# EasyEDA Pro project ProProject_Access Control Core_2024-05-28.epro, schematic V2.0.1 Core Schematic

## Sheets
1 Microcontroller: Create Date: 2024-05-01; Page Name: Microcontroller; Project Name: Access Control V2; Schematic Name: V2.0.1 Core Schematic; Update Date: 2024-05-13; Company: EasyEDA.com; Drawn: EasyEDA; Page Size: A4; Part Number: JLCPCB-002; Reviewed: EasyEDA; Version: V0.1
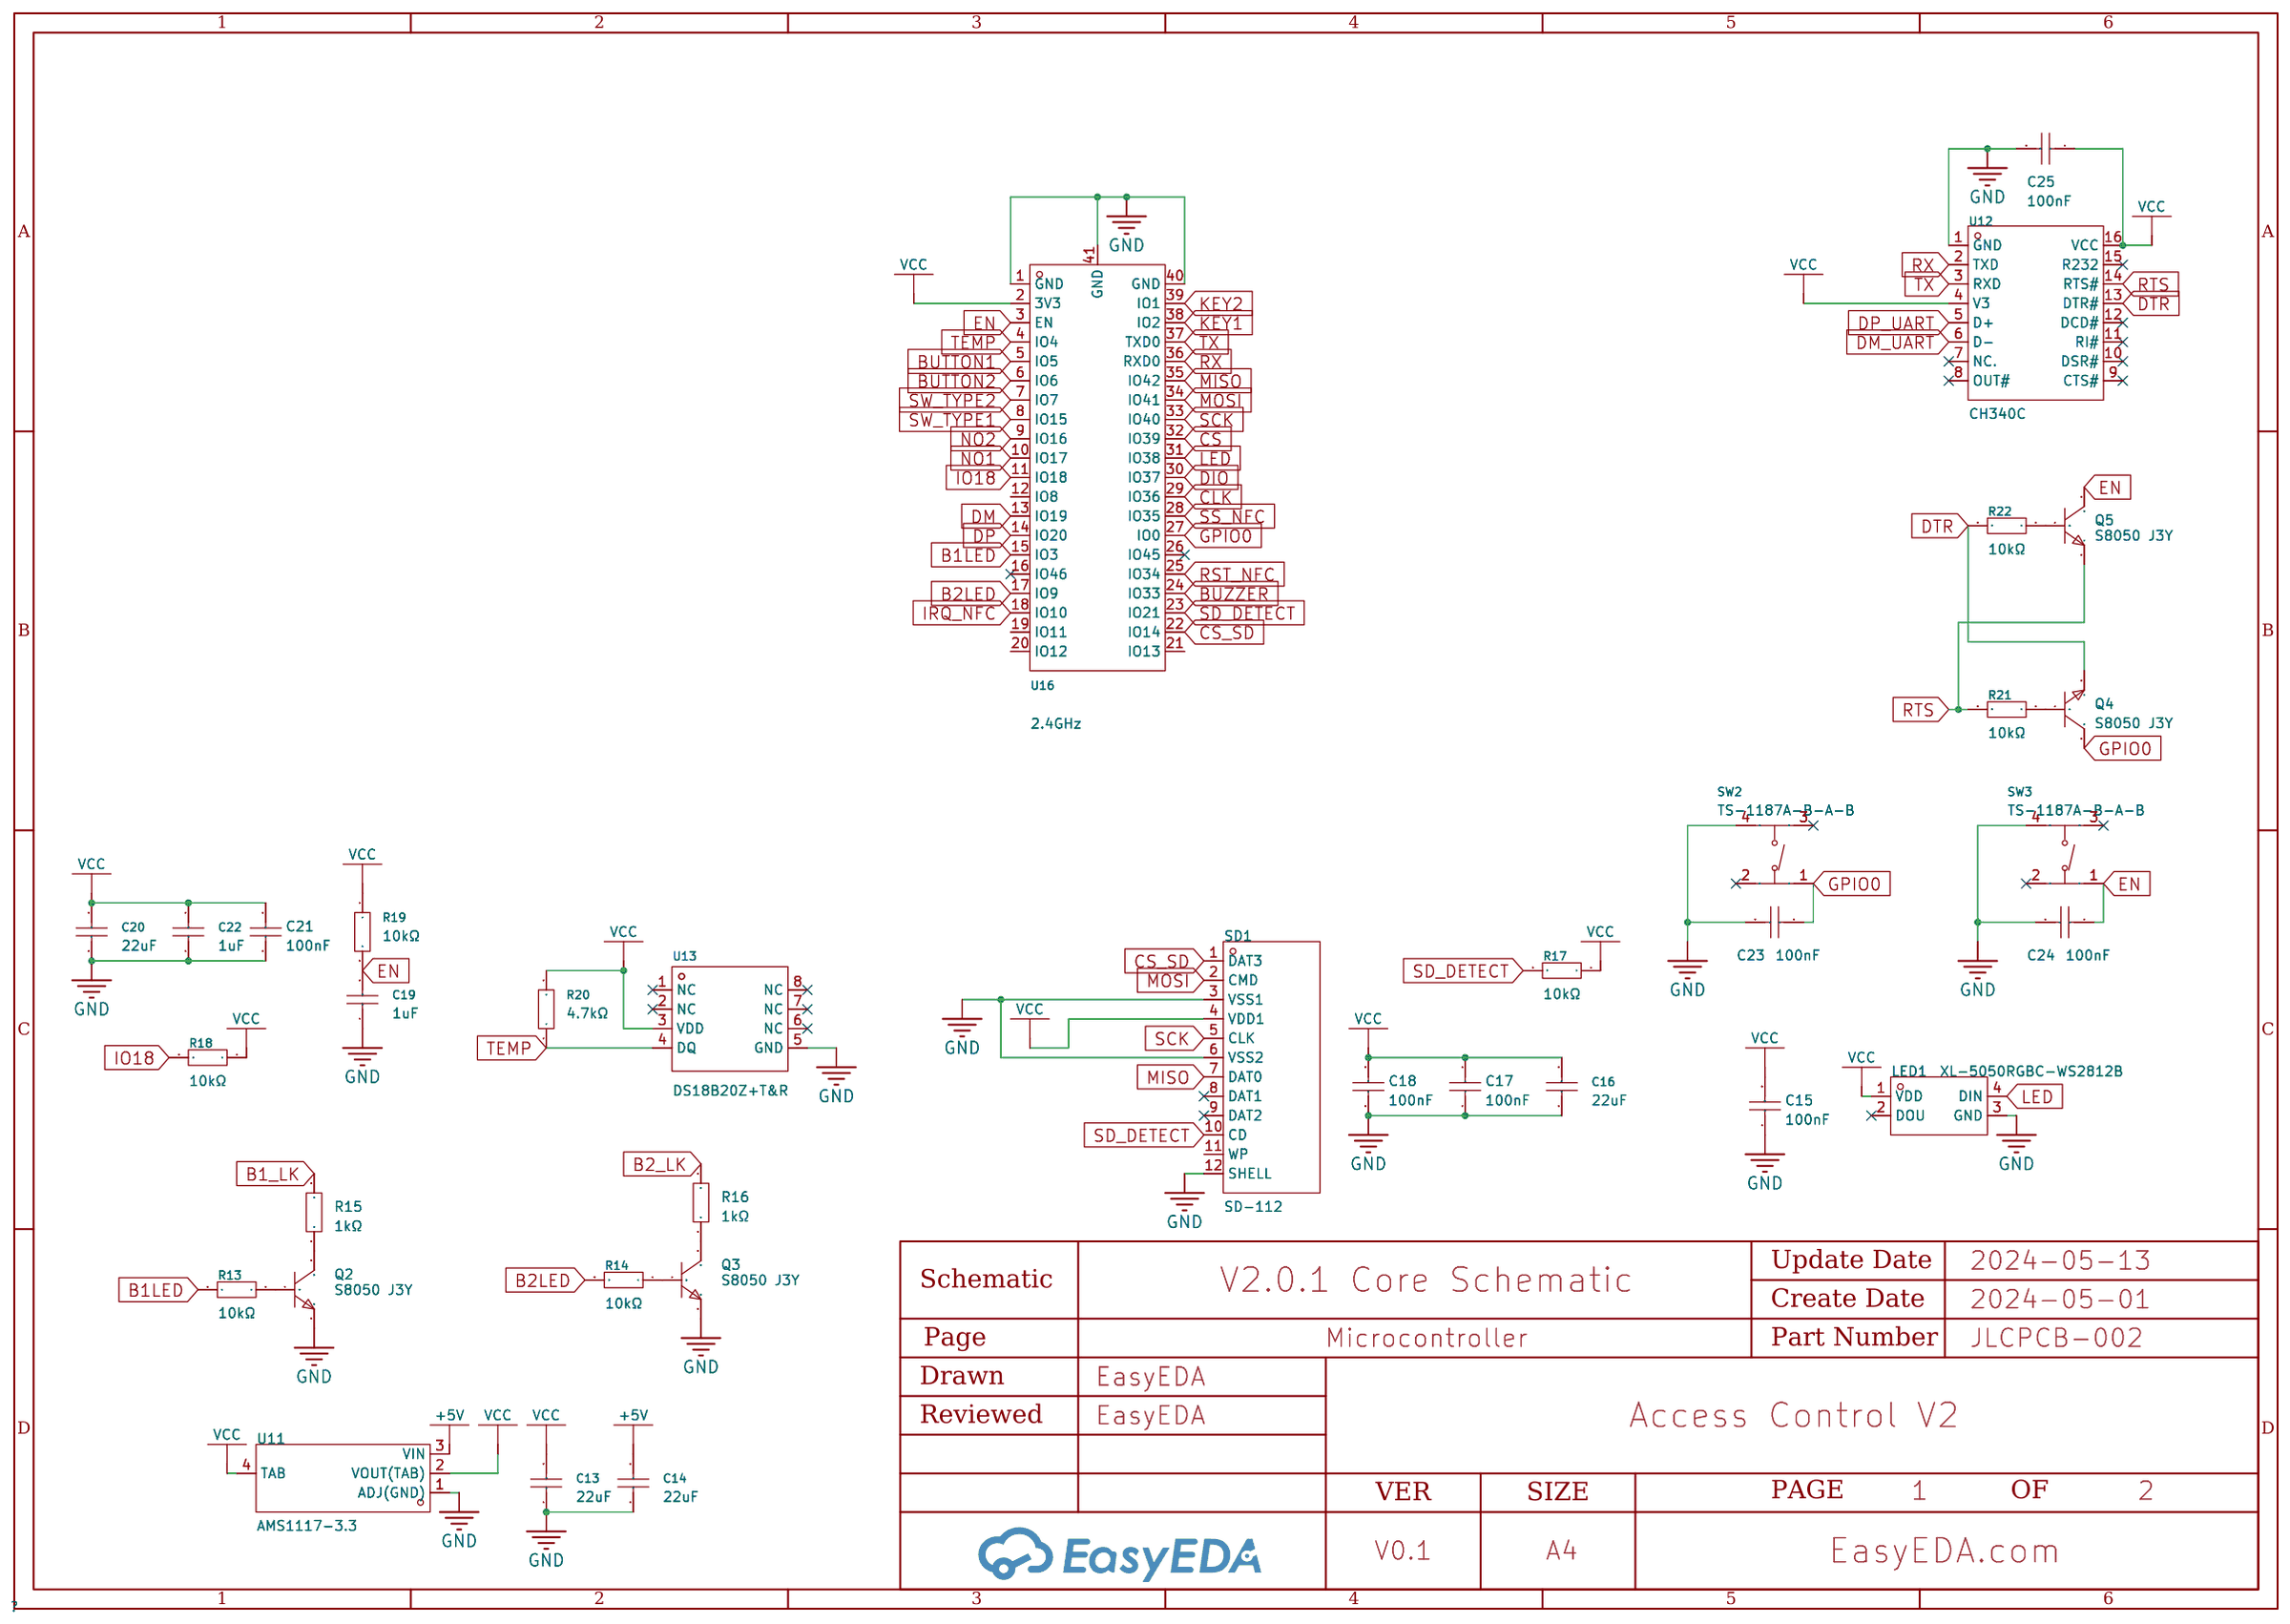
[diagram p0: Microcontroller]
2 Interfaces: Page Name: Interfaces
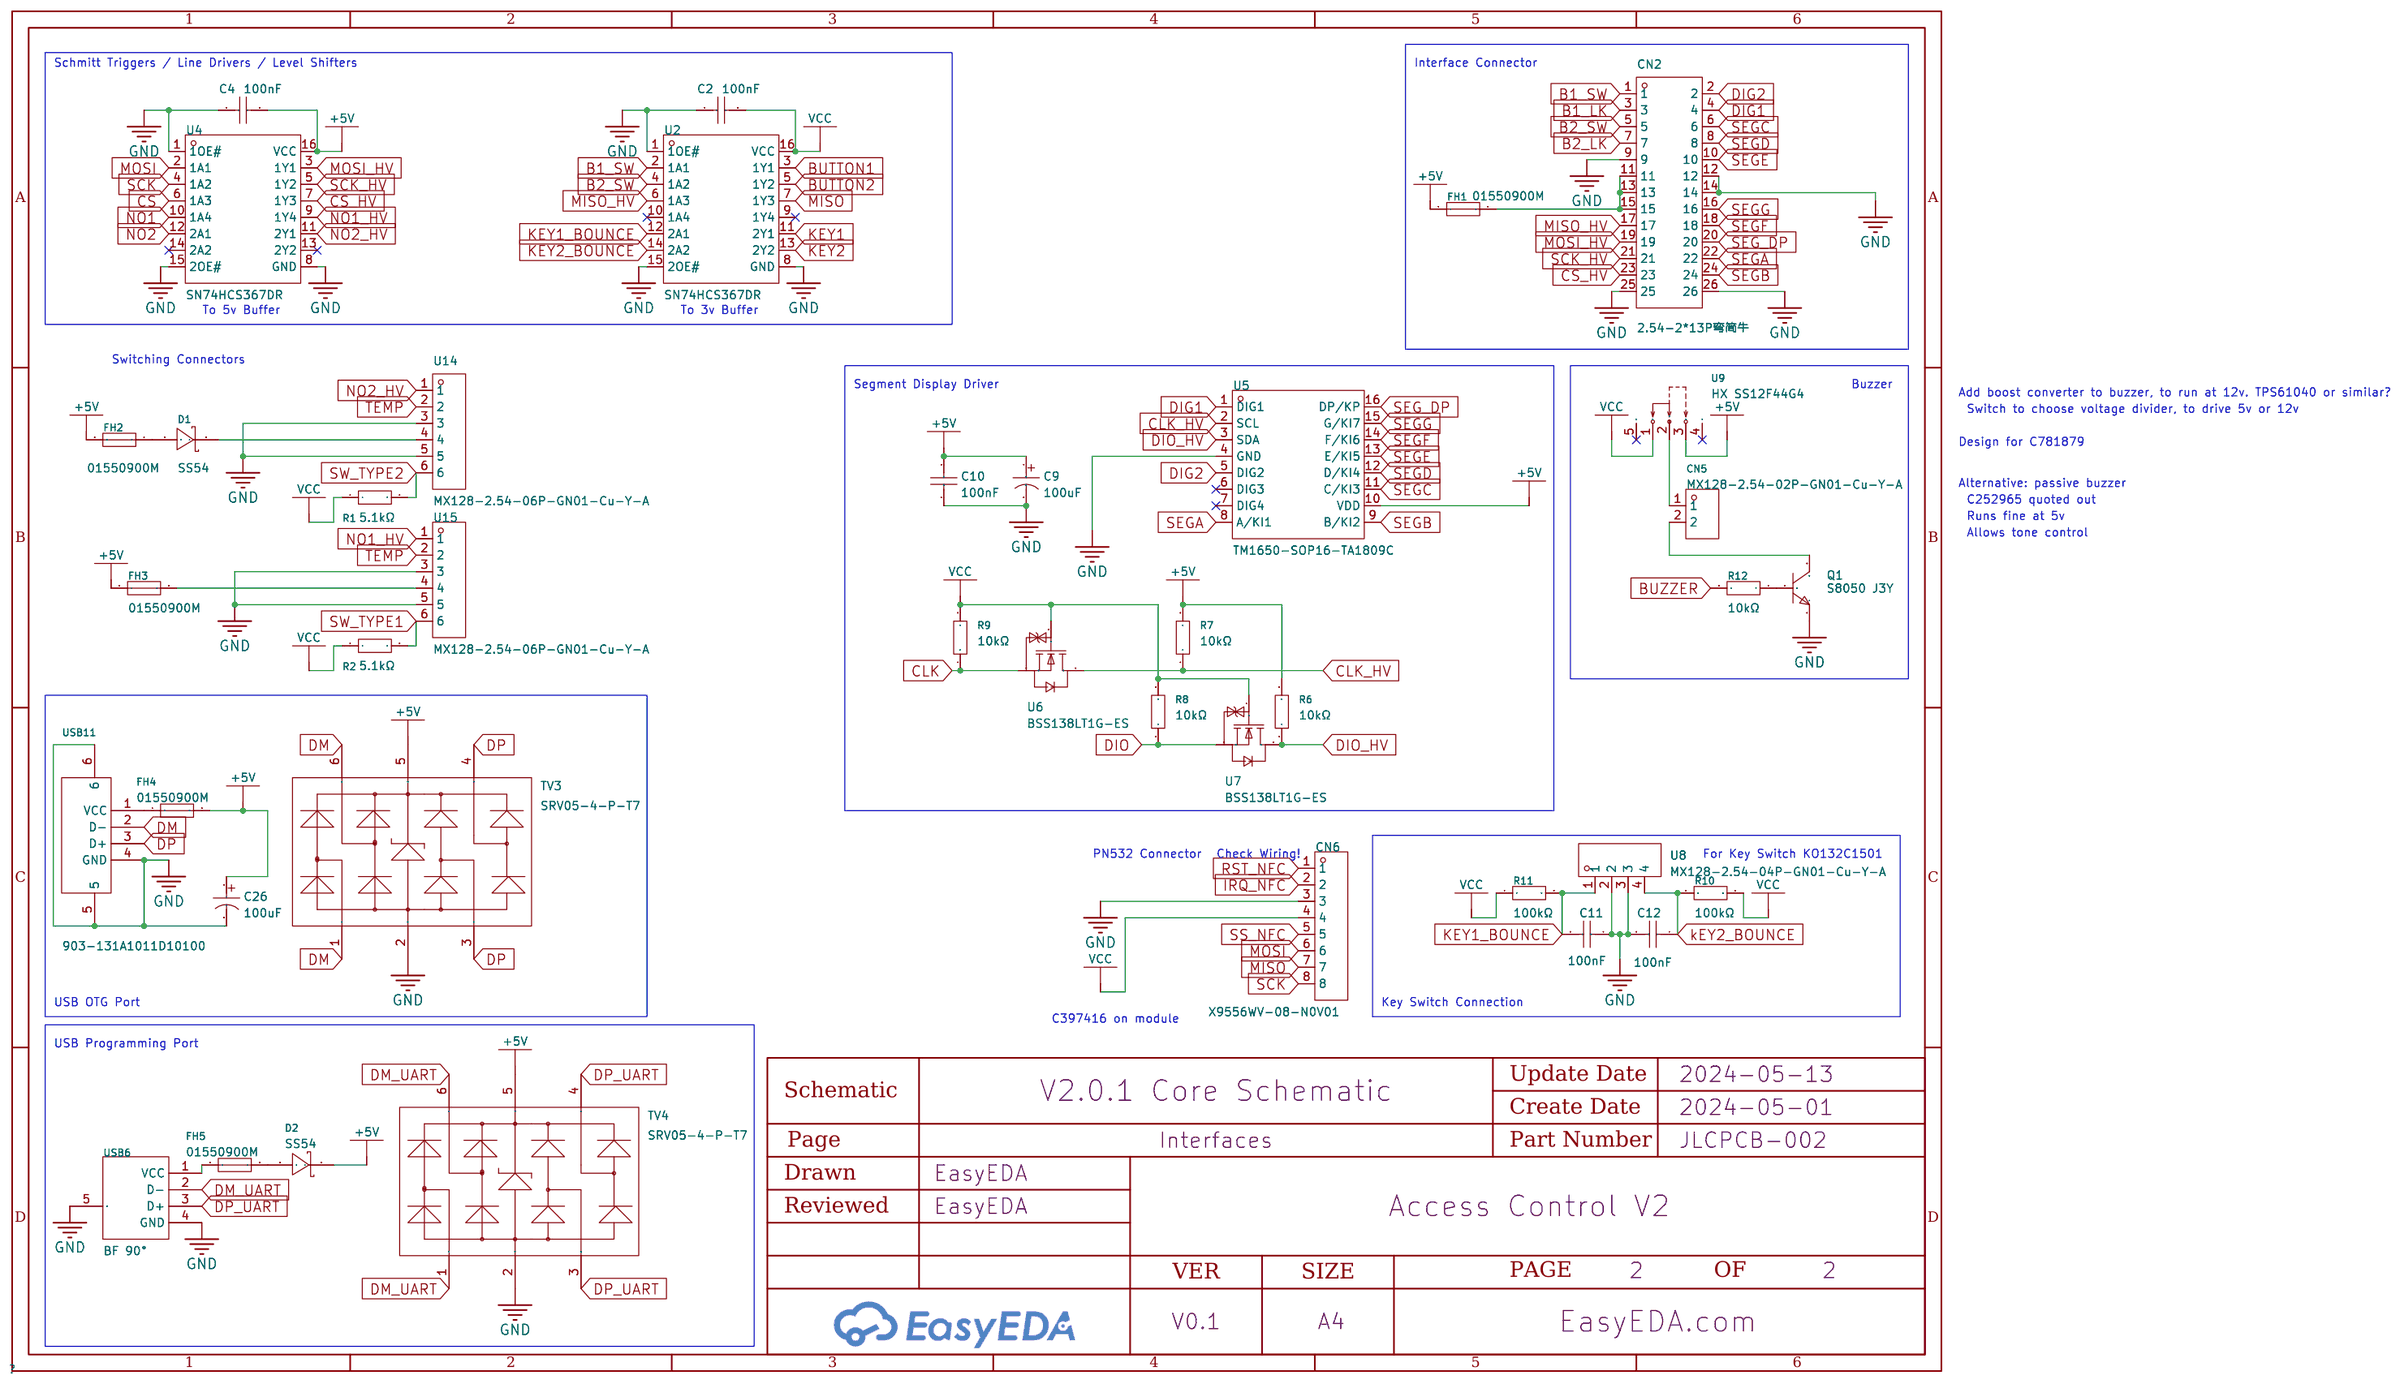
[diagram p1: Interfaces]

## Parts
sheet Interfaces
C2  100nF  [C0805]
C4  100nF  [C0805]
C9  100uF  [CAP-TH_BD5.0-P2.00-D0.8-FD]
C10  100nF  [C0805]
C11  100nF  [C0805]
C12  100nF  [C0805]
C26  100uF  [CAP-TH_BD5.0-P2.00-D0.8-FD]
CN2  2.54-2*13P弯简牛  [IDC-TH_26P-P2.54_BOOMELE-2X13P-2.54MM-H]
CN5  MX128-2.54-02P-GN01-Cu-Y-A  [CONN-TH_2P-P2.54_MX128-2.54-GN01-02P-CU-Y-A]
CN6  X9556WV-08-N0V01  [CONN-TH_8P-P2.54_X9556WV-08-N0V01]
D1  SS54  [SMA_L4.4-W2.8-LS5.4-R-RD]
D2  SS54  [SMA_L4.4-W2.8-LS5.4-R-RD]
FH1  01550900M  [FUSE-SMD_L9.8-W5.0]
FH2  01550900M  [FUSE-SMD_L9.8-W5.0]
FH3  01550900M  [FUSE-SMD_L9.8-W5.0]
FH4  01550900M  [FUSE-SMD_L9.8-W5.0]
FH5  01550900M  [FUSE-SMD_L9.8-W5.0]
Q1  S8050 J3Y  [SOT-23-3_L3.0-W1.7-P0.95-LS2.9-BR]
R1  5.1kΩ  [R0805]
R2  5.1kΩ  [R0805]
R6  10kΩ  [R0805]
R7  10kΩ  [R0805]
R8  10kΩ  [R0805]
R9  10kΩ  [R0805]
R10  100kΩ  [R0805]
R11  100kΩ  [R0805]
R12  10kΩ  [R0805]
TV3  SRV05-4-P-T7  [SOT-23-6_L2.9-W1.6-P0.95-LS2.8-BR]
TV4  SRV05-4-P-T7  [SOT-23-6_L2.9-W1.6-P0.95-LS2.8-BR]
U2  SN74HCS367DR  [SOIC-16_L9.9-W3.9-P1.27-LS6.0-BL-1]
U4  SN74HCS367DR  [SOIC-16_L9.9-W3.9-P1.27-LS6.0-BL-1]
U5  TM1650-SOP16-TA1809C  [SOP-16_L10.0-W3.9-P1.27-LS6.0-BL]
U6  BSS138LT1G-ES  [SOT-23_L2.9-W1.3-P1.90-LS2.4-BR]
U7  BSS138LT1G-ES  [SOT-23_L2.9-W1.3-P1.90-LS2.4-BR]
U8  MX128-2.54-04P-GN01-Cu-Y-A  [CONN-TH_4P-P2.54_MX128-2.54-GN01-04P-CU-Y-A]
U9  HX SS12F44G4  [SW-TH_SHOU-HAN_SS12F44G4]
U14  MX128-2.54-06P-GN01-Cu-Y-A  [CONN-TH_6P-P2.54_MX128-2.54-6P]
U15  MX128-2.54-06P-GN01-Cu-Y-A  [CONN-TH_6P-P2.54_MX128-2.54-6P]
USB6  BF 90°  [USB-B_TH_BF90]
USB11  903-131A1011D10100  [USB-A-TH_C46407]
sheet Microcontroller
C13  22uF  [C1206]
C14  22uF  [C1206]
C15  100nF  [C0805]
C16  22uF  [C1206]
C17  100nF  [C0805]
C18  100nF  [C0805]
C19  1uF  [C0805]
C20  22uF  [C1206]
C21  100nF  [C0805]
C22  1uF  [C0805]
C23  100nF  [C0805]
C24  100nF  [C0805]
C25  100nF  [C0805]
LED1  XL-5050RGBC-WS2812B  [LED-SMD_4P-L5.0-W5.0-BL_XL-5050RGBC]
Q2  S8050 J3Y  [SOT-23-3_L3.0-W1.7-P0.95-LS2.9-BR]
Q3  S8050 J3Y  [SOT-23-3_L3.0-W1.7-P0.95-LS2.9-BR]
Q4  S8050 J3Y  [SOT-23-3_L3.0-W1.7-P0.95-LS2.9-BR]
Q5  S8050 J3Y  [SOT-23-3_L3.0-W1.7-P0.95-LS2.9-BR]
R13  10kΩ  [R0805]
R14  10kΩ  [R0805]
R15  1kΩ  [R0805]
R16  1kΩ  [R0805]
R17  10kΩ  [R0805]
R18  10kΩ  [R0805]
R19  10kΩ  [R0805]
R20  4.7kΩ  [R0805]
R21  10kΩ  [R0805]
R22  10kΩ  [R0805]
SD1  SD-112  [SD-SMD_SD-112]
SW2  TS-1187A-B-A-B  [SW-SMD_4P-L5.1-W5.1-P3.70-LS6.5-TL-2]
SW3  TS-1187A-B-A-B  [SW-SMD_4P-L5.1-W5.1-P3.70-LS6.5-TL-2]
U11  AMS1117-3.3  [SOT-223-4_L6.5-W3.5-P2.30-LS7.0-BR]
U12  CH340C  [SOP-16_L10.0-W3.9-P1.27-LS6.0-BL]
U13  DS18B20Z+T&R  [SOIC-8_L4.9-W3.9-P1.27-LS6.0-BL]
U16  2.4GHz  [WIRELM-SMD_ESP32-S3-WROOM-1]

## Library data of the parts
C2 C4 C10-C12 C15 C17 C18 C21 C23-C25 = CC0805KRX7R9BB104: Capacitance: Tolerance:±10% Tolerance:±10% Voltage Rated: Temperature Coefficient:; LCSC Part Name: 100nF ±10% 50V; Supplier Part: C49678; Manufacturer: YAGEO(国巨); Supplier Footprint: 0805; JLCPCB Part Class: Basic Part; Datasheet: https://atta.szlcsc.com/upload/public/pdf/source/20180224/C181747_15194369449651363981.pdf; Supplier: LCSC; Tolerance: ±10%
C9 C26 = KS107M016D07RR0VH2FP0: Capacitance:100uF Tolerance:±20% Tolerance:±20% Rated Voltage: Ripple Current:- Equivalent Series Resistance(ESR):- Lead Spacing: φD: L: Lifetime @ Temp:1000hrs@105℃ Operating Temperature:-40℃~+105℃ Operating Temperature:-40℃~+105℃; LCSC Part Name: 100uF ±20% 16V; Supplier Part: C43803; Manufacturer: CX(承兴); Supplier Footprint: 插件,D5xL7mm; JLCPCB Part Class: Extended Part; Datasheet: https://atta.szlcsc.com/upload/public/pdf/source/20230817/0DB19D47181DB7F2222DAA6444591EF5.pdf; Supplier: LCSC; Tolerance: ±20%; Lifetime @ Temp: 1000hrs@105℃; Operating Temperature: -40℃~+105℃
CN2 = 2.54-2*13P弯简牛: Connector Type:简牛座 Pitch:2.54mm Structure:2x13P Holder Type:Right-Angle Row Spacing:2.54mm Number of Rows:2 Pin Number in each Row:13 Contact Material:- Contact Plating:-; LCSC Part Name: 2.54mm 2x13P 排数:2 每排P数:13; Supplier Part: C21167; Manufacturer: BOOMELE(博穆精密); Supplier Footprint: 弯插,P=2.54mm; JLCPCB Part Class: Extended Part; Datasheet: https://atta.szlcsc.com/upload/public/pdf/source/20190318/C79866_F562B2ABC13A71FF1CBDB4755391DD5E.pdf; Supplier: LCSC; Connector Type: 简牛座; Pitch: 2.54mm; Structure: 2x13P; Holder Type: Right-Angle; Row Spacing: 2.54mm; Number of Rows: 2; Pin Number in each Row: 13
CN5 = MX128-2.54-02P-GN01-Cu-Y-A: Structure:1x2P Pitch:2.54mm Color:Green Mounting Style:Straight Current Rating (Max):6A Voltage Rating (Max):150V Number of Pins:2P Number of Rows:1 Wire Gauge - AWG:18~24 Wire Gauge - AWG:18~24 Wire Gauge - mm2:1 Wire Gauge - mm2:1 Number of PINs Per Row; LCSC Part Name: 2.54mm 1x2P 排数:1 每排P数:2 直插; Supplier Part: C5188442; Manufacturer: MAX(迈旭); Supplier Footprint: 插件,P=2.54mm; JLCPCB Part Class: Extended Part; Datasheet: https://atta.szlcsc.com/upload/public/pdf/source/20230914/7C75AD31AD41EB9EF855A76DB002C0D2.pdf; Supplier: LCSC; Structure: 1x2P; Pitch: 2.54mm; Color: Green; Mounting Style: Straight; Current Rating (Max): 6A; Voltage Rating (Max): 150V; Number of Pins: 2P; Number of Rows: 1; Wire Gauge - AWG: 18~24; Wire Gauge - mm2: 1; Number of PINs Per Row: 2; Contact Material: Copper Alloy; Contact Plating: Tin; Operating Temperature Range: -40℃~+105℃
CN6 = X9556WV-08-N0V01: Pins Structure:1x8P Pitch:2.54mm Mounting Style:Straight Reference Series:- Number of Pins:8P Number of Rows:1 Number of PINs Per Row:8 Row Spacing:- Current Rating (Max):3A Contact Material:Brass Contact Plating:Tin Operating Temperature Range:- Operatin; LCSC Part Name: 1x8P 间距:2.54mm 直插; Supplier Part: C397407; Manufacturer: XKB Connection(中国星坤); Supplier Footprint: 插件,P=2.54mm; JLCPCB Part Class: Extended Part; Datasheet: https://atta.szlcsc.com/upload/public/pdf/source/20211009/29F6A6601B8B0251536EC4657E012C1F.pdf; Supplier: LCSC; Pins Structure: 1x8P; Pitch: 2.54mm; Mounting Style: Straight; Number of Pins: 8P; Number of Rows: 1; Number of PINs Per Row: 8; Current Rating (Max): 3A; Contact Material: Brass; Contact Plating: Tin
D1 D2 = SS54_C22452: Forward Voltage (Vf@If):550mV@5A Reverse Voltage (Vr):40V Average Rectified Current (Io):5A Reverse Leakage Current (Ir):1mA@40V; LCSC Part Name: 电压:40V 电流:5A; Supplier Part: C22452; Manufacturer: MDD; Supplier Footprint: SMA(DO-214AC); JLCPCB Part Class: Basic Part; Datasheet: https://atta.szlcsc.com/upload/public/pdf/source/20230314/529CD85F9B31F69841D3A079BC07E377.pdf; Supplier: LCSC; Forward Voltage (Vf@If): 550mV@5A; Reverse Voltage (Vr): 40V; Average Rectified Current (Io): 5A; Reverse Leakage Current (Ir): 1mA@40V
FH1-FH5 = 01550900M: Fuseholder Type:- Fuse Type:- Fuse Size:-; Supplier Part: C108518; Manufacturer: Littelfuse(美国力特); Supplier Footprint: SMD,5.0x9.7mm; JLCPCB Part Class: Extended Part; Datasheet: https://atta.szlcsc.com/upload/public/pdf/source/20181031/C315847_D8C8759CD5ED576C0EA975A2D5312378.pdf; Supplier: LCSC
Q1-Q5 = S8050 J3Y_C2146: Transistor Type: Collector Current (Ic): Collector-Emitter Breakdown Voltage (Vceo): Power Dissipation (Pd): DC Current Gain (hFE@Ic,Vce):200@50mA,1V DC Current Gain (hFE@Ic,Vce):200@50mA,1V Transition Frequency (fT):150MHz Collector Cut-Off Current (Icbo; LCSC Part Name: S8050 J3Y(RANGE:200-350) H档(200-350); Supplier Part: C2146; Manufacturer: CJ(江苏长电/长晶); Supplier Footprint: SOT-23; JLCPCB Part Class: Basic Part; Datasheet: https://atta.szlcsc.com/upload/public/pdf/source/20140809/1457707209234.pdf; Supplier: LCSC; DC Current Gain (hFE@Ic,Vce): 200@50mA,1V; Transition Frequency (fT): 150MHz; Collector Cut-Off Current (Icbo): 100nA; Collector-Emitter Saturation Voltage (VCE(sat)@Ic,Ib): 600mV@500mA,50mA
R1 R2 = 0805W8F5101T5E: Type:Thick Film Resistors Resistance:5.1kΩ Tolerance:±1% Tolerance:±1% Power(Watts): Overload Voltage (Max): Temperature Coefficient:±100ppm/℃ Temperature Coefficient:±100ppm/℃ Operating Temperature Range:-55℃~+155℃ Operating Temperature Range:-55℃~+155℃; LCSC Part Name: 5.1kΩ ±1% 125mW 厚膜电阻; Supplier Part: C27834; Manufacturer: UNI-ROYAL(厚声); Supplier Footprint: 0805; JLCPCB Part Class: Basic Part; Datasheet: https://atta.szlcsc.com/upload/public/pdf/source/20200306/C422600_1E6D84923E4A46A82E41ADD87F860B5C.pdf; Supplier: LCSC; Type: Thick Film Resistors; Tolerance: ±1%; Temperature Coefficient: ±100ppm/℃; Operating Temperature Range: -55℃~+155℃
R6-R9 R12-R14 R17-R19 R21 R22 = 0805W8F1002T5E: Type:Thick Film Resistors Resistance:10kΩ Tolerance:±1% Tolerance:±1% Power(Watts): Overload Voltage (Max): Temperature Coefficient:±100ppm/℃ Temperature Coefficient:±100ppm/℃ Operating Temperature Range:-55℃~+155℃ Operating Temperature Range:-55℃~+155℃; LCSC Part Name: 10kΩ ±1% 125mW 厚膜电阻; Supplier Part: C17414; Manufacturer: UNI-ROYAL(厚声); Supplier Footprint: 0805; JLCPCB Part Class: Basic Part; Datasheet: https://atta.szlcsc.com/upload/public/pdf/source/20200306/C422600_1E6D84923E4A46A82E41ADD87F860B5C.pdf; Supplier: LCSC; Type: Thick Film Resistors; Tolerance: ±1%; Temperature Coefficient: ±100ppm/℃; Operating Temperature Range: -55℃~+155℃
R10 R11 = 0805W8F1003T5E: Type:Thick Film Resistors Resistance:100kΩ Tolerance:±1% Tolerance:±1% Power(Watts): Overload Voltage (Max): Temperature Coefficient:±100ppm/℃ Temperature Coefficient:±100ppm/℃ Operating Temperature Range:-55℃~+155℃ Operating Temperature Range:-55℃~+155℃; LCSC Part Name: 100kΩ ±1% 125mW 厚膜电阻; Supplier Part: C149504; Manufacturer: UNI-ROYAL(厚声); Supplier Footprint: 0805; JLCPCB Part Class: Basic Part; Datasheet: https://atta.szlcsc.com/upload/public/pdf/source/20200306/C422600_1E6D84923E4A46A82E41ADD87F860B5C.pdf; Supplier: LCSC; Type: Thick Film Resistors; Tolerance: ±1%; Temperature Coefficient: ±100ppm/℃; Operating Temperature Range: -55℃~+155℃
TV3 TV4 = SRV05-4-P-T7_C85364: Reverse Stand-Off Voltage (Vrwm):5V Breakdown Voltage:6V Peak Pulse Current (Ipp)@10/1000s:1A@8/20us Maximum Clamping Voltage:12V; LCSC Part Name: Vrwm:5V; Supplier Part: C85364; Manufacturer: PROTEK; Supplier Footprint: SOT-23-6; Datasheet: https://atta.szlcsc.com/upload/public/pdf/source/20161024/1477288764689.pdf; Supplier: LCSC; Reverse Stand-Off Voltage (Vrwm): 5V; Breakdown Voltage: 6V; Peak Pulse Current (Ipp)@10/1000μs: 1A@8/20us; Maximum Clamping Voltage: 12V
U2 U4 = SN74HCS367DR: Input type:Schmitt Trigger output type:Tri-State Supply Voltage:2V~6V Supply Voltage:2V~6V Number of Elements:2 Number of Bits per Element:6 Sink Current:7.8mA Source Current:7.8mA Logic Family:74HCS Operating Temperature:-40℃~+125℃ Operating Temperature:; Supplier Part: C3756951; Manufacturer: TI(德州仪器); Supplier Footprint: SOIC-16; Datasheet: https://www.ti.com/cn/lit/gpn/sn74hcs367; Supplier: LCSC; Input type: Schmitt Trigger; output type: Tri-State; Supply Voltage: 2V~6V; Number of Elements: 2; Number of Bits per Element: 6; Sink Current: 7.8mA; Source Current: 7.8mA; Logic Family: 74HCS; Operating Temperature: -40℃~+125℃
U5 = TM1650-SOP16-TA1809C: Supplier Part: C22374376; Manufacturer: TM(天微); Supplier Footprint: SOP-16; JLCPCB Part Class: Extended Part; Datasheet: https://atta.szlcsc.com/upload/public/pdf/source/20240401/69E29AB59A432C6008276407709336EB.pdf; Supplier: LCSC
U6 U7 = BSS138LT1G-ES: Type:1个NChannel Drain Source Voltage (Vdss): Continuous Drain Current (Id): Power Dissipation (Pd): Drain Source On Resistance (RDS(on)@Vgs,Id):1.5Ω@10V,500mA Gate Threshold Voltage (Vgs(th)@Id):1V@250uA Total Gate Charge (Qg@Vgs):650pC Input Capacitance; LCSC Part Name: 1个N沟道 耐压:50V 电流:300mA; Supplier Part: C5224261; Manufacturer: ElecSuper(静芯微); Supplier Footprint: SOT-23; JLCPCB Part Class: Extended Part; Datasheet: https://atta.szlcsc.com/upload/public/pdf/source/20230109/BF1B01F1B7DA8CE5713DE49989F30FFC.pdf; Supplier: LCSC; Type: 1个NChannel; Drain Source On Resistance (RDS(on)@Vgs,Id): 1.5Ω@10V,500mA; Gate Threshold Voltage (Vgs(th)@Id): 1V@250uA; Total Gate Charge (Qg@Vgs): 650pC; Input Capacitance (Ciss@Vds): 25pF; Reverse Transfer Capacitance (Crss@Vds): 2.2pF
U8 = MX128-2.54-04P-GN01-Cu-Y-A: Structure:1x4P Pitch:2.54mm Color:Green Mounting Style:Straight Current Rating (Max):6A Voltage Rating (Max):150V Number of Pins:4P Number of Rows:1 Wire Gauge - AWG:18~24 Wire Gauge - AWG:18~24 Wire Gauge - mm2:1 Wire Gauge - mm2:1 Number of PINs Per Row; LCSC Part Name: 2.54mm 1x4P 排数:1 每排P数:4 直插; Supplier Part: C5188444; Manufacturer: MAX(迈旭); Supplier Footprint: 插件,P=2.54mm; JLCPCB Part Class: Extended Part; Datasheet: https://atta.szlcsc.com/upload/public/pdf/source/20230914/7C75AD31AD41EB9EF855A76DB002C0D2.pdf; Supplier: LCSC; Structure: 1x4P; Pitch: 2.54mm; Color: Green; Mounting Style: Straight; Current Rating (Max): 6A; Voltage Rating (Max): 150V; Number of Pins: 4P; Number of Rows: 1; Wire Gauge - AWG: 18~24; Wire Gauge - mm2: 1; Number of PINs Per Row: 4; Contact Material: Copper Alloy; Contact Plating: Tin; Operating Temperature Range: -40℃~+105℃
U9 = HX SS12F44G4: LCSC Part Name: 拨动开关 立式两档拨动,单排3PIN脚+2固定脚插件,12.2x5.5x6,黑柄4mm; Supplier Part: C5149844; Manufacturer: hanxia(韩下); Supplier Footprint: 插件; Datasheet: https://atta.szlcsc.com/upload/public/pdf/source/20220907/7744BC3E7D0676B683701560C23A620B.pdf; Supplier: LCSC
U14 U15 = MX128-2.54-06P-GN01-Cu-Y-A: Structure:1x6P Pitch:2.54mm Color:Green Mounting Style:Straight Current Rating (Max):6A Voltage Rating (Max):150V Number of Pins:6P Number of Rows:1 Wire Gauge - AWG:18~24 Wire Gauge - AWG:18~24 Wire Gauge - mm2:1 Wire Gauge - mm2:1 Number of PINs Per Row; LCSC Part Name: 2.54mm 1x6P 排数:1 每排P数:6 直插; Supplier Part: C5188446; Manufacturer: MAX(迈旭); Supplier Footprint: 插件,P=2.54mm; JLCPCB Part Class: Extended Part; Datasheet: https://atta.szlcsc.com/upload/public/pdf/source/20230914/7C75AD31AD41EB9EF855A76DB002C0D2.pdf; Supplier: LCSC; Structure: 1x6P; Pitch: 2.54mm; Color: Green; Mounting Style: Straight; Current Rating (Max): 6A; Voltage Rating (Max): 150V; Number of Pins: 6P; Number of Rows: 1; Wire Gauge - AWG: 18~24; Wire Gauge - mm2: 1; Number of PINs Per Row: 6; Contact Material: Copper Alloy; Contact Plating: Tin; Operating Temperature Range: -40℃~+105℃
USB6 = BF 90°: Connector Type:Type-B Standard:USB 2.0 Gender:Female Number of Ports:1 Number of Contacts:4P Mounting Style:Right-Angle Current Rating - Power (Max):1.5A Operating Temperature Range:-25℃~+85℃ Operating Temperature Range:-25℃~+85℃; LCSC Part Name: Type-B 母 弯插; Supplier Part: C456014; Manufacturer: SHOU HAN(首韩); Supplier Footprint: 插件; JLCPCB Part Class: Extended Part; Datasheet: https://atta.szlcsc.com/upload/public/pdf/source/20191113/C456014_C740506ED5D4B26CF619D62A688F072E.pdf; Supplier: LCSC; Connector Type: Type-B; Standard: USB 2.0; Gender: Female; Number of Ports: 1; Number of Contacts: 4P; Mounting Style: Right-Angle; Current Rating - Power (Max): 1.5A; Operating Temperature Range: -25℃~+85℃
USB11 = 903-131A1011D10100: Connector Type:Type-A Standard:USB 2.0 Gender:Female Number of Ports:1 Number of Contacts:4P Current Rating - Power (Max):1.5A; LCSC Part Name: Type-A 母; Supplier Part: C46407; Manufacturer: 精拓金; Supplier Footprint: 插件; JLCPCB Part Class: Extended Part; Datasheet: https://atta.szlcsc.com/upload/public/pdf/source/20210301/C46407_0FDCFD777E72B2503A3E09AE32E4643C.pdf; Supplier: LCSC; Connector Type: Type-A; Standard: USB 2.0; Gender: Female; Number of Ports: 1; Number of Contacts: 4P; Current Rating - Power (Max): 1.5A
C13 C14 C16 C20 = CL31A226KAHNNNE: Capacitance: Tolerance:±10% Tolerance:±10% Voltage Rated: Temperature Coefficient:; LCSC Part Name: 22uF ±10% 25V; Supplier Part: C12891; Manufacturer: SAMSUNG(三星); Supplier Footprint: 1206; JLCPCB Part Class: Basic Part; Datasheet: https://atta.szlcsc.com/upload/public/pdf/source/20160218/1457707763339.pdf; Supplier: LCSC; Tolerance: ±10%
C19 C22 = CL21B105KBFNNNE: Capacitance: Tolerance:±10% Tolerance:±10% Voltage Rated: Temperature Coefficient:; LCSC Part Name: 1uF ±10% 50V; Supplier Part: C28323; Manufacturer: SAMSUNG(三星); Supplier Footprint: 0805; JLCPCB Part Class: Basic Part; Datasheet: https://atta.szlcsc.com/upload/public/pdf/source/20160218/1457707763339.pdf; Supplier: LCSC; Tolerance: ±10%
LED1 = XL-5050RGBC-WS2812B: Supplier Part: C2843785; Manufacturer: XINGLIGHT(成兴光); Supplier Footprint: SMD5050; JLCPCB Part Class: Extended Part; Datasheet: https://atta.szlcsc.com/upload/public/pdf/source/20240412/E1004CAA80592E31D08BFE019083806F.pdf; Supplier: LCSC
R15 R16 = 0805W8F1001T5E: Type:Thick Film Resistors Resistance:1kΩ Tolerance:±1% Tolerance:±1% Power(Watts): Overload Voltage (Max): Temperature Coefficient:±100ppm/℃ Temperature Coefficient:±100ppm/℃ Operating Temperature Range:-55℃~+155℃ Operating Temperature Range:-55℃~+155℃; LCSC Part Name: 1kΩ ±1% 125mW 厚膜电阻; Supplier Part: C17513; Manufacturer: UNI-ROYAL(厚声); Supplier Footprint: 0805; JLCPCB Part Class: Basic Part; Datasheet: https://atta.szlcsc.com/upload/public/pdf/source/20200306/C422600_1E6D84923E4A46A82E41ADD87F860B5C.pdf; Supplier: LCSC; Type: Thick Film Resistors; Tolerance: ±1%; Temperature Coefficient: ±100ppm/℃; Operating Temperature Range: -55℃~+155℃
R20 = 0805W8F4701T5E: Type:Thick Film Resistors Resistance:4.7kΩ Tolerance:±1% Tolerance:±1% Power(Watts): Overload Voltage (Max): Temperature Coefficient:±100ppm/℃ Temperature Coefficient:±100ppm/℃ Operating Temperature Range:-55℃~+155℃ Operating Temperature Range:-55℃~+155℃; LCSC Part Name: 4.7kΩ ±1% 125mW 厚膜电阻; Supplier Part: C17673; Manufacturer: UNI-ROYAL(厚声); Supplier Footprint: 0805; JLCPCB Part Class: Basic Part; Datasheet: https://atta.szlcsc.com/upload/public/pdf/source/20200306/C422600_1E6D84923E4A46A82E41ADD87F860B5C.pdf; Supplier: LCSC; Type: Thick Film Resistors; Tolerance: ±1%; Temperature Coefficient: ±100ppm/℃; Operating Temperature Range: -55℃~+155℃
SD1 = SD-112: Card Connection Mode:Pluggable Card Type:StandardSD卡 Connector Type:Deck Maximum Body Height:2.75mm Contact Plating:Gold Operating Temperature Range:-25℃~+90℃ Operating Temperature Range:-25℃~+90℃; LCSC Part Name: 拔插式 标准SD卡 卡座; Supplier Part: C961673; Manufacturer: HANBO(汉博); Supplier Footprint: SMD; JLCPCB Part Class: Extended Part; Datasheet: https://atta.szlcsc.com/upload/public/pdf/source/20221111/3DA5FA45280C889584A9D758FC9BB3ED.pdf; Supplier: LCSC; Card Connection Mode: Pluggable; Card Type: StandardSD卡; Connector Type: Deck; Maximum Body Height: 2.75mm; Contact Plating: Gold; Operating Temperature Range: -25℃~+90℃
SW2 SW3 = TS-1187A-B-A-B: Circuit:SPST Actuator Style:Round Button Operating Force:160gf Mounting Style:Brick nogging Switch Length:5.1mm Switch Width:5.1mm Switch Height:1.5mm Strike Gundam:不带 Contact Current:50mA Voltage Rating (DC):12V Insulation Resistance:- Actuator/Cap Color; LCSC Part Name: 5.1*5.1*1.5mm 立贴 轻触开关; Supplier Part: C318884; Manufacturer: XKB Connectivity(中国星坤); Supplier Footprint: SMD; JLCPCB Part Class: Basic Part; Datasheet: https://atta.szlcsc.com/upload/public/pdf/source/20200227/C318890_053E50208A88A7BA1965D8746000774E.pdf; Supplier: LCSC; Circuit: SPST; Actuator Style: Round Button; Operating Force: 160gf; Mounting Style: Brick nogging; Switch Length: 5.1mm; Switch Width: 5.1mm; Switch Height: 1.5mm; Strike Gundam: 不带; Contact Current: 50mA; Voltage Rating (DC): 12V; Actuator/Cap Color: 金色; With Lamp: No; Mechanical Life: 10万次; Operating Temperature: -30℃~+85℃
U11 = AMS1117-3.3_C347222: Output Type: Maximum Input Voltage:12V Output Voltage:3.3V Output Voltage:3.3V MAX Output Current:1A Power Supply Rejection Ratio (PSRR):60dB@(120Hz) Dropout Voltage:1.3V@(1A) standby current:- Noise:- Feature:- Operating Temperature:- Operating Temperatu; LCSC Part Name: 输出:3.3V 电流:1A 耐压:12V; Supplier Part: C347222; Manufacturer: UMW(友台半导体); Supplier Footprint: SOT-223; JLCPCB Part Class: Extended Part; Datasheet: https://atta.szlcsc.com/upload/public/pdf/source/20231109/155D79A26D9DB04352555A58D5969DC8.pdf; Supplier: LCSC; Maximum Input Voltage: 12V; Output Voltage: 3.3V; MAX Output Current: 1A; Power Supply Rejection Ratio (PSRR): 60dB@(120Hz); Dropout Voltage: 1.3V@(1A); Output Polarity: Positive electrode; Number of Outputs: 1
U12 = CH340C: Applications Function:Transceiver Protocol: Supply Voltage:3.3V；5V Supply Voltage:3.3V；5V Data Rate:2Mbps; LCSC Part Name: CH340C USB转串口芯片 CH340; Supplier Part: C84681; Manufacturer: WCH(南京沁恒); Supplier Footprint: SOP-16; JLCPCB Part Class: Extended Part; Datasheet: https://atta.szlcsc.com/upload/public/pdf/source/20200819/C84681_ADBED554CE321879DBD6B1D06488689C.pdf; Supplier: LCSC; Applications Function: Transceiver; Supply Voltage: 3.3V；5V; Data Rate: 2Mbps
U13 = DS18B20Z+T&R: Supply Voltage:3V~5.5V Supply Voltage:3V~5.5V; LCSC Part Name: DS18B20Z&R; Supplier Part: C97190; Manufacturer: ADI(亚德诺)/MAXIM(美信); Supplier Footprint: SOIC-8; JLCPCB Part Class: Extended Part; Datasheet: https://atta.szlcsc.com/upload/public/pdf/source/20170713/C118507_1499918901893816791.pdf; Supplier: LCSC; Supply Voltage: 3V~5.5V
U16 = ESP32-S2-SOLO-2-N4: Core Processor:ESP32-S2芯片 Support Interface:I2C；GPIO；SPI；PWM；ADC；UART；USB；I2S Frequency:2.4GHz Output Power:19.5dBm Output Power:19.5dBm; Supplier Part: C3040594; Manufacturer: ESPRESSIF(乐鑫); Supplier Footprint: SMD-41P; JLCPCB Part Class: Extended Part; Datasheet: https://atta.szlcsc.com/upload/public/pdf/source/20220829/68E69EF550BFD22B9418B9E05FF4E453.pdf; Supplier: LCSC; Core Processor: ESP32-S2芯片; Support Interface: I2C；GPIO；SPI；PWM；ADC；UART；USB；I2S; Output Power: 19.5dBm

## Nets
+5V: C4.2 C9.1 C10.2 C14.2 C26.1 D2.2(K) FH1.1 FH2.2 FH3.2 FH4.2 R6.2 R7.2 TV3.5 TV4.5 U4.16(VCC) U5.10(VDD) U9.3 U11.3(VIN)
GND: C2.1 C4.1 C9.2 C10.1 C11.1 C12.2 C13.1 C14.1 C15.1 C16.1 C17.1 C18.1 C19.1 C20.1 C21.1 C22.1 C23.2 C24.2 C25.2 C26.2 CN2.9 CN2.12 CN2.14 CN2.25 CN2.26 CN6.3 LED1.3(GND) Q1.2(E) Q2.2(E) Q3.2(E) SD1.3(VSS1) SD1.6(VSS2) SD1.12(SHELL) SW2.4(D) SW3.4(D) TV3.2 TV4.2 U2.1(1OE#) U2.8(GND) U2.15(2OE#) U4.1(1OE#) U4.8(GND) U4.15(2OE#) U5.4(GND) U8.2 U8.3 U11.1(ADJ(GND)) U12.1(GND) U13.5(GND) U14.3 U14.5 U15.3 U15.5 U16.1(GND) U16.40(GND) U16.41(GND) USB6.4(GND) USB6.5(EH) USB11.4(GND) USB11.5 USB11.6
VCC: C2.2 C13.2 C15.2 C16.2 C17.2 C18.2 C20.2 C21.2 C22.2 C25.1 CN6.4 LED1.1(VDD) R1.1 R2.1 R8.2 R9.2 R10.2 R11.1 R17.1 R18.1 R19.1 R20.2 SD1.4(VDD1) U2.16(VCC) U6.1(G) U7.1(G) U9.1 U11.2(VOUT(TAB)) U11.4(TAB) U12.4(V3) U12.16(VCC) U13.3(VDD) U16.2(3V3)
B1_LK: CN2.3 R15.2
B1_SW: CN2.1 U2.2(1A1)
B1LED: R13.2 U16.15(IO3)
B2_LK: CN2.7 R16.2
B2_SW: CN2.5 U2.4(1A2)
B2LED: R14.2 U16.17(IO9)
BUTTON1: U2.3(1Y1) U16.5(IO5)
BUTTON2: U2.5(1Y2) U16.6(IO6)
BUZZER: R12.2 U16.24(IO33)
CLK: R9.1 U6.2(S) U16.29(IO36)
CLK_HV: R7.1 U5.2(SCL) U6.3(D)
CS: U4.6(1A3) U16.32(IO39)
CS_HV: CN2.23 U4.7(1Y3)
CS_SD: SD1.1(DAT3) U16.22(IO14)
DIG1: CN2.4 U5.1(DIG1)
DIG2: CN2.2 U5.5(DIG2)
DIO: R8.1 U7.2(S) U16.30(IO37)
DIO_HV: R6.1 U5.3(SDA) U7.3(D)
DM: TV3.1 TV3.6 U16.13(IO19) USB11.2(D-)
DM_UART: TV4.1 TV4.6 U12.6(D-) USB6.2(D-)
DP: TV3.3 TV3.4 U16.14(IO20) USB11.3(D+)
DP_UART: TV4.3 TV4.4 U12.5(D+) USB6.3(D+)
DTR: Q4.2(E) R22.2 U12.13(DTR#)
EN: C19.2 C24.1 Q5.3(C) R19.2 SW3.1(A) U16.3(EN)
GPIO0: C23.1 Q4.3(C) SW2.1(A) U16.27(IO0)
IO18: R18.2 U16.11(IO18)
IRQ_NFC: CN6.2 U16.18(IO10)
KEY1: U2.11(2Y1) U16.38(IO2)
KEY1_BOUNCE: C11.2 R11.2 U2.12(2A1) U8.1
KEY2: U2.13(2Y2) U16.39(IO1)
KEY2_BOUNCE: U2.14(2A2)
kEY2_BOUNCE: C12.1 R10.1 U8.4
LED: LED1.4(DIN) U16.31(IO38)
MISO: CN6.7 SD1.7(DAT0) U2.7(1Y3) U16.35(IO42)
MISO_HV: CN2.17 U2.6(1A3)
MOSI: CN6.6 SD1.2(CMD) U4.2(1A1) U16.34(IO41)
MOSI_HV: CN2.19 U4.3(1Y1)
NO1: U4.10(1A4) U16.10(IO17)
NO1_HV: U4.9(1Y4) U15.1
NO2: U4.12(2A1) U16.9(IO16)
NO2_HV: U4.11(2Y1) U14.1
RST_NFC: CN6.1 U16.25(IO34)
RTS: Q5.2(E) R21.2 U12.14(RTS#)
RX: U12.2(TXD) U16.36(RXD0)
SCK: CN6.8 SD1.5(CLK) U4.4(1A2) U16.33(IO40)
SCK_HV: CN2.21 U4.5(1Y2)
SD_DETECT: R17.2 SD1.10(CD) U16.23(IO21)
SEG_DP: CN2.20 U5.16(DP/KP)
SEGA: CN2.22 U5.8(A/KI1)
SEGB: CN2.24 U5.9(B/KI2)
SEGC: CN2.6 U5.11(C/KI3)
SEGD: CN2.8 U5.12(D/KI4)
SEGE: CN2.10 U5.13(E/KI5)
SEGF: CN2.18 U5.14(F/KI6)
SEGG: CN2.16 U5.15(G/KI7)
SS_NFC: CN6.5 U16.28(IO35)
SW_TYPE1: R2.2 U15.6 U16.8(IO15)
SW_TYPE2: R1.2 U14.6 U16.7(IO7)
TEMP: R20.1 U13.4(DQ) U14.2 U15.2 U16.4(IO4)
TX: U12.3(RXD) U16.37(TXD0)
$1N1268: Q2.1(B) R13.1
$1N1379: Q3.1(B) R14.1
$1N1451: Q2.3(C) R15.1
$1N1490: Q3.3(C) R16.1
$1N3803: Q5.1(B) R22.1
$1N3805: Q4.1(B) R21.1
$2N1552: CN2.11 CN2.13 CN2.15 FH1.2
$2N8179: D2.1(A) FH5.2
$2N8183: FH5.1 USB6.1(VCC)
$2N8184: FH4.1 USB11.1(VCC)
$2N9449: CN5.1 U9.2
$2N9639: Q1.1(B) R12.1
$2N9646: CN5.2 Q1.3(C)
$2N17292: D1.1(A) FH2.1
$2N17305: D1.2(K) U14.4
$2N17355: FH3.1 U15.4

Not connected (* = marked no-connect by the designer): LED1 2(DOU)*; SD1 8(DAT1)* 9(DAT2)* 11(WP); SW2 2(B)* 3(C)*; SW3 2(B)* 3(C)*; U2 9(1Y4)* 10(1A4)*; U4 13(2Y2)* 14(2A2)*; U5 6(DIG3)* 7(DIG4)*; U9 4* 5*; U12 7(NC.)* 8(OUT#)* 9(CTS#)* 10(DSR#)* 11(RI#)* 12(DCD#)* 15(R232)*; U13 1(NC)* 2(NC)* 6(NC)* 7(NC)* 8(NC)*; U16 12(IO8) 16(IO46)* 19(IO11) 20(IO12) 21(IO13) 26(IO45)*

## Notes on the sheets
sheet 2
- Schmitt Triggers / Line Drivers / Level Shifters
- Interface Connector
- To 5v Buffer
- To 3v Buffer
- Switching Connectors
- Segment Display Driver
- Buzzer
- Add boost converter to buzzer, to run at 12v. TPS61040 or similar?
- Switch to choose voltage divider, to drive 5v or 12v
- Design for C781879
- Alternative: passive buzzer
- C252965 quoted out
- Runs fine at 5v
- Allows tone control
- PN532 Connector
- Check Wiring!
- For Key Switch KO132C1501
- USB OTG Port
- Key Switch Connection
- C397416 on module
- USB Programming Port
